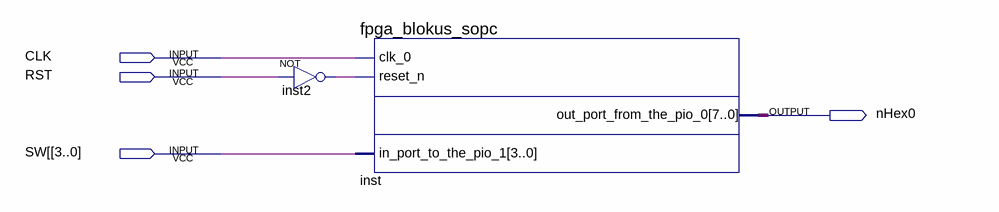
[diagram p0: schematic sheet]
// Quartus schematic fpga_blokus.bdf as structural Verilog: 2 symbols, 4 pins
module fpga_blokus (
  input  CLK,
  input  RST,
  input  [3:0] \SW[ ,
  output nHex0
);

  wire inst2_out;
  wire [7:0] inst_out_port_from_the_pio_0;

  not inst2 (inst2_out, RST);
  fpga_blokus_sopc inst (
    .clk_0(CLK), .reset_n(inst2_out), .in_port_to_the_pio_1(\SW[ ),
    .out_port_from_the_pio_0(inst_out_port_from_the_pio_0));
endmodule
